# Altium schematic sheet SMPS.SchDoc: Title (part 2 of 2)
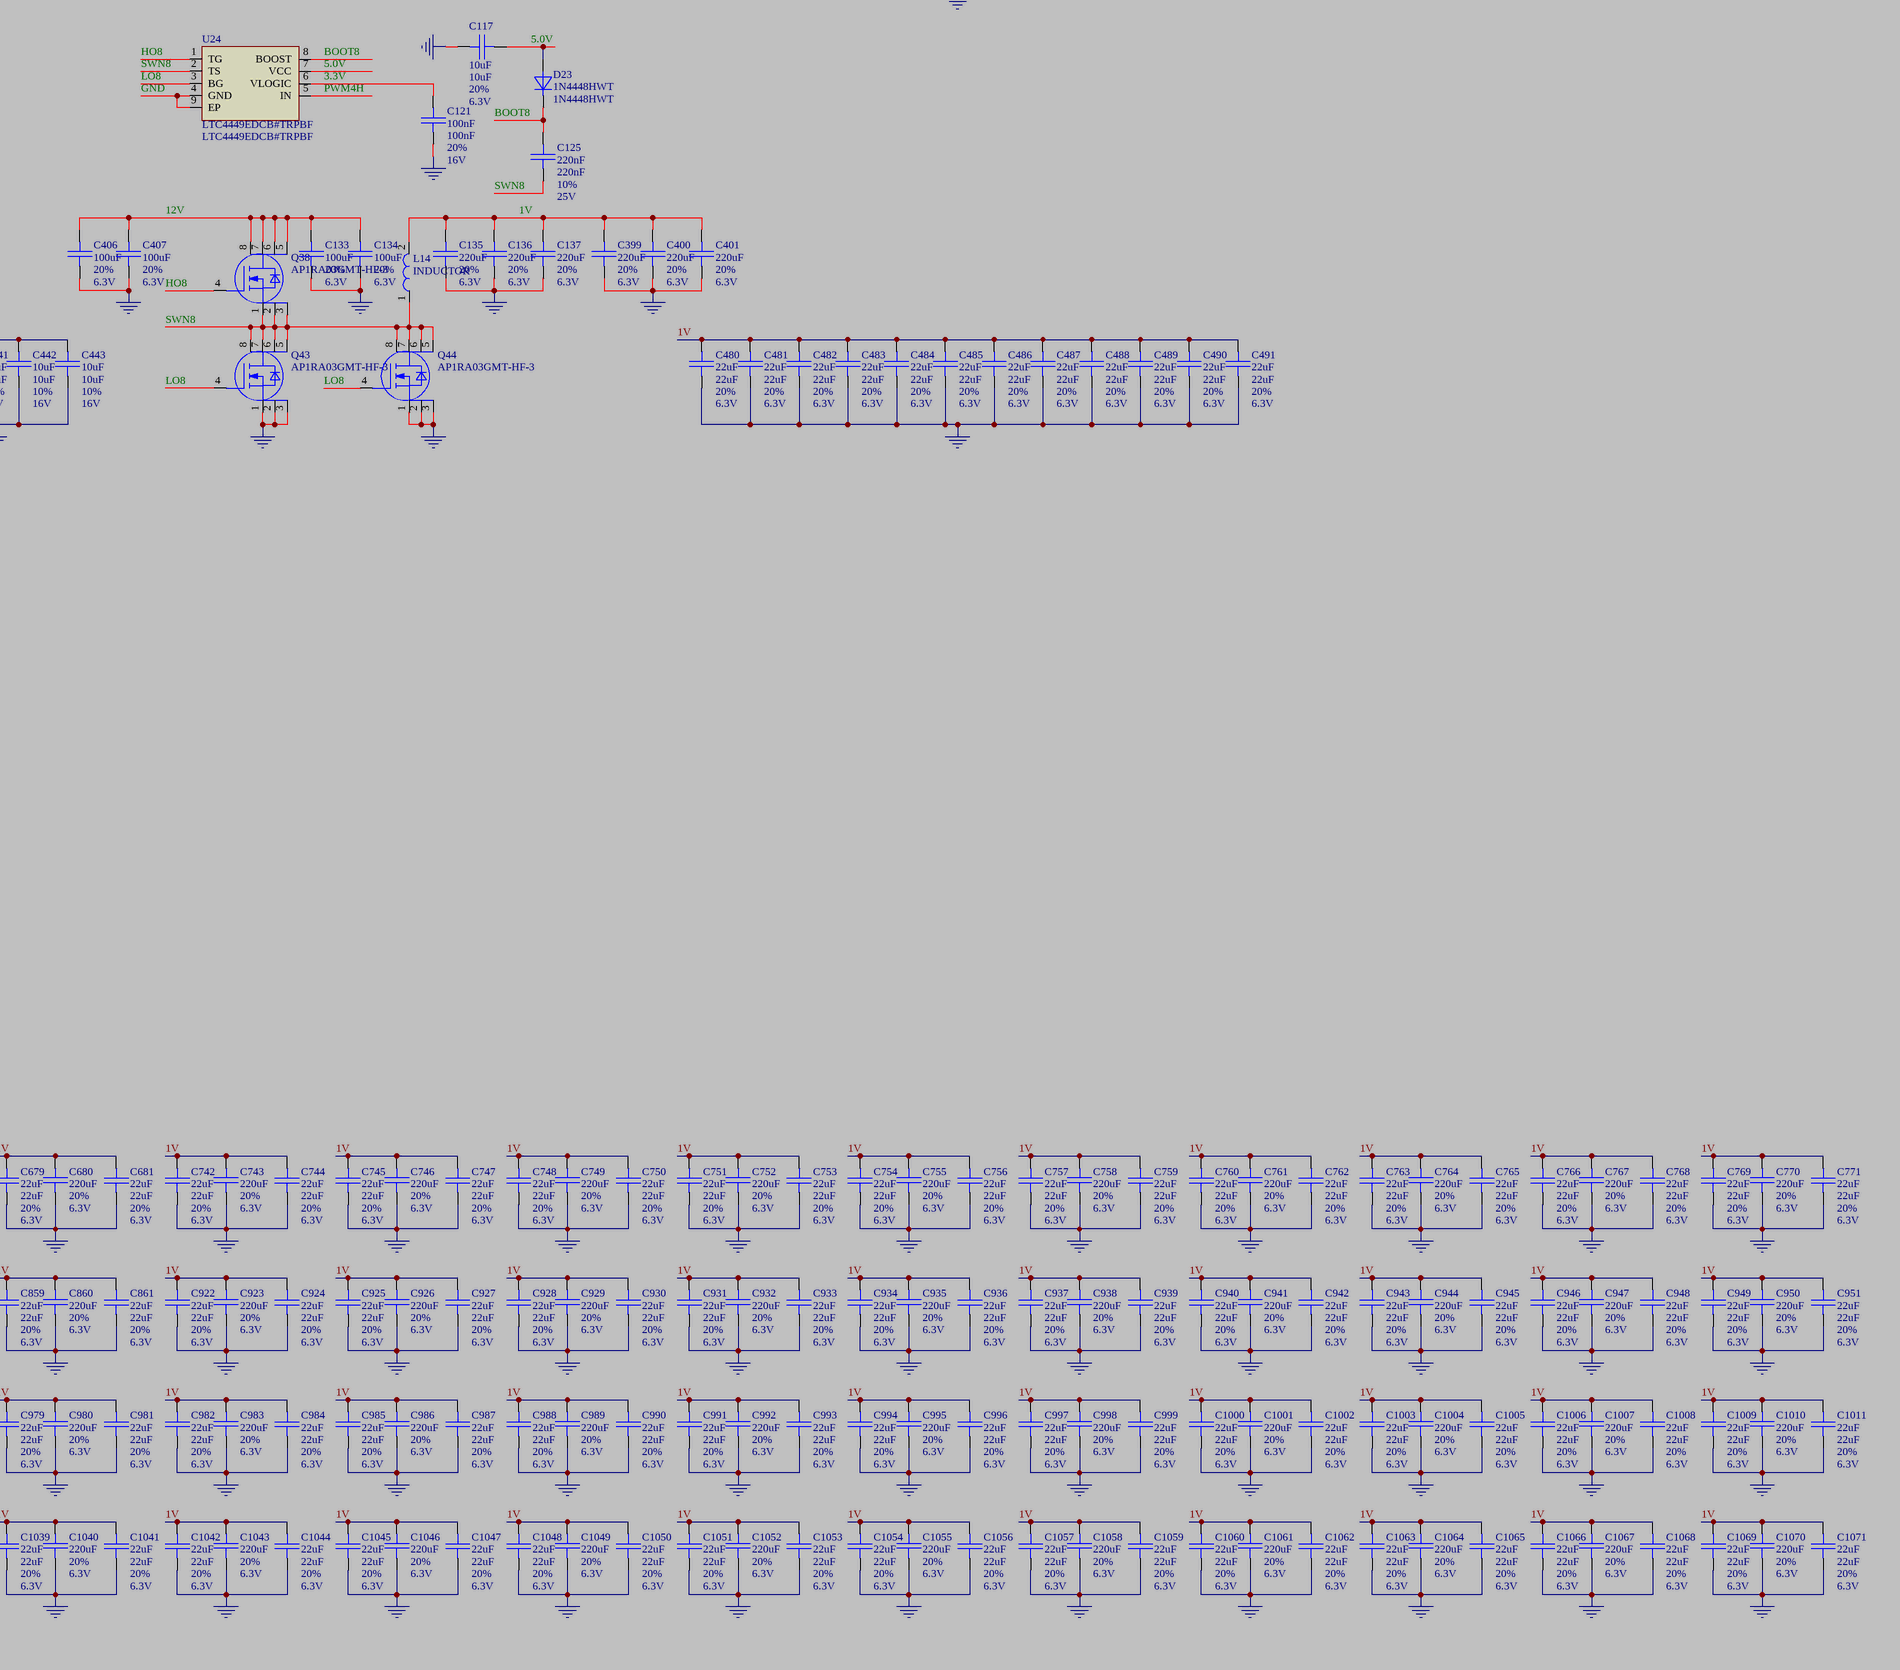
[diagram p4: SMPS.SchDoc, bottom right]

## Nets
GND: C20.1 C21.1 C24.2 C25.2 C32.1 C33.1 C34.1 C35.1 C37.1 C38.1 C39.1 C40.1 C41.1 C52.1 C53.1 C56.2 C57.2 C64.1 C65.1 C66.1 C67.1 C68.1 C69.1 C70.1 C71.1 C72.1 C73.1 C84.1 C85.1 C88.2 C89.2 C96.1 C97.1 C98.1 C99.1 C100.1 C101.1 C102.1 C103.1 C104.1 C105.1 C116.1 C117.1 C120.2 C121.2 C128.1 C129.1 C130.1 C131.1 C132.1 C133.1 C134.1 C135.1 C136.1 C137.1 C236.1 C323.2 C324.2 C325.2 C326.2 C327.2 C328.2 C329.2 C330.2 C331.2 C332.2 C333.2 C334.2 C335.2 C336.2 C337.2 C338.2 C339.2 C340.2 C341.2 C342.2 C343.2 C344.2 C345.2 C346.2 C348.1 C349.1 C350.1 C351.1 C352.1 C353.2 C354.2 C355.2 C356.2 C357.2 C358.2 C359.2 C360.2 C361.2 C362.2 C363.2 C364.2 C365.2 C366.2 C367.2 C368.2 C369.2 C370.2 C371.2 C372.2 C373.2 C374.2 C375.2 C376.2 C377.2 C378.2 C379.2 C380.2 C381.2 C382.2 C383.2 C384.2 C385.2 C386.2 C387.2 C388.2 C389.2 C390.2 C391.2 C392.2 C393.1 C394.1 C395.1 C396.1 C397.1 C398.1 C399.1 C400.1 C401.1 C402.1 C403.1 C404.1 C405.1 C406.1 C407.1 C408.1 C409.1 C410.1 C411.1 C412.1 C413.1 C414.1 C415.1 C416.1 C417.1 C418.1 C419.1 C420.1 C421.1 C422.1 C423.1 C424.1 C425.1 C426.1 C427.1 C428.2 C429.2 C430.2 C431.2 C432.2 C433.2 C434.2 C435.2 C436.2 C437.2 C438.2 C439.2 C440.2 C441.2 C442.2 C443.2 C444.2 C445.2 C446.2 C447.2 C448.2 C449.2 C450.2 C451.2 C452.2 C453.2 C454.2 C455.2 C456.2 C457.2 C458.2 C459.2 C460.2 C461.2 C462.2 C463.2 C464.2 C465.2 C466.2 C467.2 C468.2 C469.2 C470.2 C471.2 C472.2 C473.2 C474.2 C475.2 C476.2 C477.2 C478.2 C479.2 C480.2 C481.2 C482.2 C483.2 C484.2 C485.2 C486.2 C487.2 C488.2 C489.2 C490.2 C491.2 C593.1 C596.1 C598.2 C599.1 C600.2 C602.1 C603.2 C605.1 C606.2 C640.2 C642.2 C643.2 C645.2 C646.2 C652.2 C653.1 C654.2 C655.2 C656.1 C657.2 C658.2 C659.1 C660.2 C661.2 C662.1 C663.2 C664.2 C665.1 C666.2 C667.2 C668.1 C669.2 C670.2 C671.1 C672.2 C673.2 C674.1 C675.2 C676.2 C677.1 C678.2 C679.2 C680.1 C681.2 C686.1 C688.2 C689.1 C692.1 C695.1 C711.2 C712.2 C714.2 C715.2 C717.2 C742.2 C743.1 C744.2 C745.2 C746.1 C747.2 C748.2 C749.1 C750.2 C751.2 C752.1 C753.2 C754.2 C755.1 C756.2 C757.2 C758.1 C759.2 C760.2 C761.1 C762.2 C763.2 C764.1 C765.2 C766.2 C767.1 C768.2 C769.2 C770.1 C771.2 C776.1 C779.1 C782.1 C785.1 C807.2 C808.2 C810.2 C811.2 C813.2 C814.2 C832.2 C833.1 C834.2 C835.2 C836.1 C837.2 C838.2 C839.1 C840.2 C841.2 C842.1 C843.2 C844.2 C845.1 C846.2 C847.2 C848.1 C849.2 C850.2 C851.1 C852.2 C853.2 C854.1 C855.2 C856.2 C857.1 C858.2 C859.2 C860.1 C861.2 C866.1 C868.2 C869.1 C872.1 C876.2 C877.2 C879.2 C880.2 C882.2 C913.2 C915.2 C916.2 C918.2 C919.2 C922.2 C923.1 C924.2 C925.2 C926.1 C927.2 C928.2 C929.1 C930.2 C931.2 C932.1 C933.2 C934.2 C935.1 C936.2 C937.2 C938.1 C939.2 C940.2 C941.1 C942.2 C943.2 C944.1 C945.2 C946.2 C947.1 C948.2 C949.2 C950.1 C951.2 C952.2 C953.1 C954.2 C955.2 C956.1 C957.2 C958.2 C959.1 C960.2 C961.2 C962.1 C963.2 C964.2 C965.1 C966.2 C967.2 C968.1 C969.2 C970.2 C971.1 C972.2 C973.2 C974.1 C975.2 C976.2 C977.1 C978.2 C979.2 C980.1 C981.2 C982.2 C983.1 C984.2 C985.2 C986.1 C987.2 C988.2 C989.1 C990.2 C991.2 C992.1 C993.2 C994.2 C995.1 C996.2 C997.2 C998.1 C999.2 C1000.2 C1001.1 C1002.2 C1003.2 C1004.1 C1005.2 C1006.2 C1007.1 C1008.2 C1009.2 C1010.1 C1011.2 C1012.2 C1013.1 C1014.2 C1015.2 C1016.1 C1017.2 C1018.2 C1019.1 C1020.2 C1021.2 C1022.1 C1023.2 C1024.2 C1025.1 C1026.2 C1027.2 C1028.1 C1029.2 C1030.2 C1031.1 C1032.2 C1033.2 C1034.1 C1035.2 C1036.2 C1037.1 C1038.2 C1039.2 C1040.1 C1041.2 C1042.2 C1043.1 C1044.2 C1045.2 C1046.1 C1047.2 C1048.2 C1049.1 C1050.2 C1051.2 C1052.1 C1053.2 C1054.2 C1055.1 C1056.2 C1057.2 C1058.1 C1059.2 C1060.2 C1061.1 C1062.2 C1063.2 C1064.1 C1065.2 C1066.2 C1067.1 C1068.2 C1069.2 C1070.1 C1071.2 Q5.1(S) Q5.2(S) Q5.3(S) Q6.1(S) Q6.2(S) Q6.3(S) Q7.1(S) Q7.2(S) Q7.3(S) Q8.1(S) Q8.2(S) Q8.3(S) Q17.1(S) Q17.2(S) Q17.3(S) Q18.1(S) Q18.2(S) Q18.3(S) Q19.1(S) Q19.2(S) Q19.3(S) Q20.1(S) Q20.2(S) Q20.3(S) Q29.1(S) Q29.2(S) Q29.3(S) Q30.1(S) Q30.2(S) Q30.3(S) Q31.1(S) Q31.2(S) Q31.3(S) Q32.1(S) Q32.2(S) Q32.3(S) Q41.1(S) Q41.2(S) Q41.3(S) Q42.1(S) Q42.2(S) Q42.3(S) Q43.1(S) Q43.2(S) Q43.3(S) Q44.1(S) Q44.2(S) Q44.3(S) U11.4(GND) U11.9(EP) U12.4(GND) U12.9(EP) U15.4(GND) U15.9(EP) U16.4(GND) U16.9(EP) U19.4(GND) U19.9(EP) U20.4(GND) U20.9(EP) U23.4(GND) U23.9(EP) U24.4(GND) U24.9(EP)
1V: C34.2 C35.2 C39.2 C40.2 C41.2 C66.2 C67.2 C68.2 C71.2 C72.2 C73.2 C98.2 C99.2 C100.2 C103.2 C104.2 C105.2 C130.2 C131.2 C132.2 C135.2 C136.2 C137.2 C236.2 C323.1 C324.1 C325.1 C326.1 C327.1 C328.1 C329.1 C330.1 C331.1 C332.1 C333.1 C334.1 C335.1 C336.1 C337.1 C338.1 C339.1 C340.1 C341.1 C342.1 C343.1 C344.1 C345.1 C346.1 C350.2 C351.2 C352.2 C353.1 C354.1 C355.1 C356.1 C357.1 C358.1 C359.1 C360.1 C361.1 C362.1 C363.1 C364.1 C365.1 C366.1 C367.1 C368.1 C369.1 C370.1 C371.1 C372.1 C373.1 C374.1 C375.1 C376.1 C393.2 C394.2 C395.2 C396.2 C397.2 C398.2 C399.2 C400.2 C401.2 C408.2 C409.2 C410.2 C411.2 C412.2 C413.2 C414.2 C415.2 C416.2 C417.2 C418.2 C419.2 C444.1 C445.1 C446.1 C447.1 C448.1 C449.1 C450.1 C451.1 C452.1 C453.1 C454.1 C455.1 C456.1 C457.1 C458.1 C459.1 C460.1 C461.1 C462.1 C463.1 C464.1 C465.1 C466.1 C467.1 C468.1 C469.1 C470.1 C471.1 C472.1 C473.1 C474.1 C475.1 C476.1 C477.1 C478.1 C479.1 C480.1 C481.1 C482.1 C483.1 C484.1 C485.1 C486.1 C487.1 C488.1 C489.1 C490.1 C491.1 C652.1 C653.2 C654.1 C655.1 C656.2 C657.1 C658.1 C659.2 C660.1 C661.1 C662.2 C663.1 C664.1 C665.2 C666.1 C667.1 C668.2 C669.1 C670.1 C671.2 C672.1 C673.1 C674.2 C675.1 C676.1 C677.2 C678.1 C679.1 C680.2 C681.1 C742.1 C743.2 C744.1 C745.1 C746.2 C747.1 C748.1 C749.2 C750.1 C751.1 C752.2 C753.1 C754.1 C755.2 C756.1 C757.1 C758.2 C759.1 C760.1 C761.2 C762.1 C763.1 C764.2 C765.1 C766.1 C767.2 C768.1 C769.1 C770.2 C771.1 C832.1 C833.2 C834.1 C835.1 C836.2 C837.1 C838.1 C839.2 C840.1 C841.1 C842.2 C843.1 C844.1 C845.2 C846.1 C847.1 C848.2 C849.1 C850.1 C851.2 C852.1 C853.1 C854.2 C855.1 C856.1 C857.2 C858.1 C859.1 C860.2 C861.1 C922.1 C923.2 C924.1 C925.1 C926.2 C927.1 C928.1 C929.2 C930.1 C931.1 C932.2 C933.1 C934.1 C935.2 C936.1 C937.1 C938.2 C939.1 C940.1 C941.2 C942.1 C943.1 C944.2 C945.1 C946.1 C947.2 C948.1 C949.1 C950.2 C951.1 C952.1 C953.2 C954.1 C955.1 C956.2 C957.1 C958.1 C959.2 C960.1 C961.1 C962.2 C963.1 C964.1 C965.2 C966.1 C967.1 C968.2 C969.1 C970.1 C971.2 C972.1 C973.1 C974.2 C975.1 C976.1 C977.2 C978.1 C979.1 C980.2 C981.1 C982.1 C983.2 C984.1 C985.1 C986.2 C987.1 C988.1 C989.2 C990.1 C991.1 C992.2 C993.1 C994.1 C995.2 C996.1 C997.1 C998.2 C999.1 C1000.1 C1001.2 C1002.1 C1003.1 C1004.2 C1005.1 C1006.1 C1007.2 C1008.1 C1009.1 C1010.2 C1011.1 C1012.1 C1013.2 C1014.1 C1015.1 C1016.2 C1017.1 C1018.1 C1019.2 C1020.1 C1021.1 C1022.2 C1023.1 C1024.1 C1025.2 C1026.1 C1027.1 C1028.2 C1029.1 C1030.1 C1031.2 C1032.1 C1033.1 C1034.2 C1035.1 C1036.1 C1037.2 C1038.1 C1039.1 C1040.2 C1041.1 C1042.1 C1043.2 C1044.1 C1045.1 C1046.2 C1047.1 C1048.1 C1049.2 C1050.1 C1051.1 C1052.2 C1053.1 C1054.1 C1055.2 C1056.1 C1057.1 C1058.2 C1059.1 C1060.1 C1061.2 C1062.1 C1063.1 C1064.2 C1065.1 C1066.1 C1067.2 C1068.1 C1069.1 C1070.2 C1071.1 L1.2 L2.2 L5.2 L6.2 L9.2 L10.2 L13.2 L14.2 ; port 1V
3.3V: C24.1 C25.1 C56.1 C57.1 C88.1 C89.1 C120.1 C121.1 U11.6(VLOGIC) U12.6(VLOGIC) U15.6(VLOGIC) U16.6(VLOGIC) U19.6(VLOGIC) U20.6(VLOGIC) U23.6(VLOGIC) U24.6(VLOGIC) ; port 3.3V
5.0V: C20.2 C21.2 C52.2 C53.2 C84.2 C85.2 C116.2 C117.2 D10.2(A) D11.2(A) D14.2(A) D15.2(A) D18.2(A) D19.2(A) D22.2(A) D23.2(A) U11.7(VCC) U12.7(VCC) U15.7(VCC) U16.7(VCC) U19.7(VCC) U20.7(VCC) U23.7(VCC) U24.7(VCC) ; port 5.0V
12V: C32.2 C33.2 C37.2 C38.2 C64.2 C65.2 C69.2 C70.2 C96.2 C97.2 C101.2 C102.2 C128.2 C129.2 C133.2 C134.2 C348.2 C349.2 C377.1 C378.1 C379.1 C380.1 C381.1 C382.1 C383.1 C384.1 C385.1 C386.1 C387.1 C388.1 C389.1 C390.1 C391.1 C392.1 C402.2 C403.2 C404.2 C405.2 C406.2 C407.2 C420.2 C421.2 C422.2 C423.2 C424.2 C425.2 C426.2 C427.2 C428.1 C429.1 C430.1 C431.1 C432.1 C433.1 C434.1 C435.1 C436.1 C437.1 C438.1 C439.1 C440.1 C441.1 C442.1 C443.1 C593.2 C596.2 C598.1 C599.2 C600.1 C602.2 C603.1 C605.2 C606.1 C640.1 C642.1 C643.1 C645.1 C646.1 C686.2 C688.1 C689.2 C692.2 C695.2 C711.1 C712.1 C714.1 C715.1 C717.1 C776.2 C779.2 C782.2 C785.2 C807.1 C808.1 C810.1 C811.1 C813.1 C814.1 C866.2 C868.1 C869.2 C872.2 C876.1 C877.1 C879.1 C880.1 C882.1 C913.1 C915.1 C916.1 C918.1 C919.1 Q1.5(D) Q1.6(D) Q1.7(D) Q1.8(D) Q2.5(D) Q2.6(D) Q2.7(D) Q2.8(D) Q13.5(D) Q13.6(D) Q13.7(D) Q13.8(D) Q14.5(D) Q14.6(D) Q14.7(D) Q14.8(D) Q25.5(D) Q25.6(D) Q25.7(D) Q25.8(D) Q26.5(D) Q26.6(D) Q26.7(D) Q26.8(D) Q37.5(D) Q37.6(D) Q37.7(D) Q37.8(D) Q38.5(D) Q38.6(D) Q38.7(D) Q38.8(D) ; port 12V
BOOT1: C28.1 D10.1(C) U11.8(BOOST)
BOOT2: C60.1 D14.1(C) U15.8(BOOST)
BOOT3: C92.1 D18.1(C) U19.8(BOOST)
BOOT4: C124.1 D22.1(C) U23.8(BOOST)
BOOT5: C29.1 D11.1(C) U12.8(BOOST)
BOOT6: C61.1 D15.1(C) U16.8(BOOST)
BOOT7: C93.1 D19.1(C) U20.8(BOOST)
BOOT8: C125.1 D23.1(C) U24.8(BOOST)
HO1: Q1.4(G) U11.1(TG)
HO2: Q13.4(G) U15.1(TG)
HO3: Q25.4(G) U19.1(TG)
HO4: Q37.4(G) U23.1(TG)
HO5: Q2.4(G) U12.1(TG)
HO6: Q14.4(G) U16.1(TG)
HO7: Q26.4(G) U20.1(TG)
HO8: Q38.4(G) U24.1(TG)
LO1: Q5.4(G) Q6.4(G) U11.3(BG)
LO2: Q17.4(G) Q18.4(G) U15.3(BG)
LO3: Q29.4(G) Q30.4(G) U19.3(BG)
LO4: Q41.4(G) Q42.4(G) U23.3(BG)
LO5: Q7.4(G) Q8.4(G) U12.3(BG)
LO6: Q19.4(G) Q20.4(G) U16.3(BG)
LO7: Q31.4(G) Q32.4(G) U20.3(BG)
LO8: Q43.4(G) Q44.4(G) U24.3(BG)
PWM1H: U12.5(IN) ; port PWM1H
PWM1L: U11.5(IN) ; port PWM1L
PWM2H: U16.5(IN) ; port PWM2H
PWM2L: U15.5(IN) ; port PWM2L
PWM3H: U20.5(IN) ; port PWM3H
PWM3L: U19.5(IN) ; port PWM3L
PWM4H: U24.5(IN) ; port PWM4H
PWM4L: U23.5(IN) ; port PWM4L
SWN1: C28.2 L1.1 Q1.1(S) Q1.2(S) Q1.3(S) Q5.5(D) Q5.6(D) Q5.7(D) Q5.8(D) Q6.5(D) Q6.6(D) Q6.7(D) Q6.8(D) U11.2(TS)
SWN2: C60.2 L5.1 Q13.1(S) Q13.2(S) Q13.3(S) Q17.5(D) Q17.6(D) Q17.7(D) Q17.8(D) Q18.5(D) Q18.6(D) Q18.7(D) Q18.8(D) U15.2(TS)
SWN3: C92.2 L9.1 Q25.1(S) Q25.2(S) Q25.3(S) Q29.5(D) Q29.6(D) Q29.7(D) Q29.8(D) Q30.5(D) Q30.6(D) Q30.7(D) Q30.8(D) U19.2(TS)
SWN4: C124.2 L13.1 Q37.1(S) Q37.2(S) Q37.3(S) Q41.5(D) Q41.6(D) Q41.7(D) Q41.8(D) Q42.5(D) Q42.6(D) Q42.7(D) Q42.8(D) U23.2(TS)
SWN5: C29.2 L2.1 Q2.1(S) Q2.2(S) Q2.3(S) Q7.5(D) Q7.6(D) Q7.7(D) Q7.8(D) Q8.5(D) Q8.6(D) Q8.7(D) Q8.8(D) U12.2(TS)
SWN6: C61.2 L6.1 Q14.1(S) Q14.2(S) Q14.3(S) Q19.5(D) Q19.6(D) Q19.7(D) Q19.8(D) Q20.5(D) Q20.6(D) Q20.7(D) Q20.8(D) U16.2(TS)
SWN7: C93.2 L10.1 Q26.1(S) Q26.2(S) Q26.3(S) Q31.5(D) Q31.6(D) Q31.7(D) Q31.8(D) Q32.5(D) Q32.6(D) Q32.7(D) Q32.8(D) U20.2(TS)
SWN8: C125.2 L14.1 Q38.1(S) Q38.2(S) Q38.3(S) Q43.5(D) Q43.6(D) Q43.7(D) Q43.8(D) Q44.5(D) Q44.6(D) Q44.7(D) Q44.8(D) U24.2(TS)

## Library data of the parts
C20 C21 C52 C53 C84 C85 C116 C117 = CAP000043646: DB_MANUFACTURER_PART: KEMET    C0603C106M9PAC; DB_PART_TYPE: Ceramic_SMD\Standard_X5R; NOTE: <NOTE>; DB_APPROVED_BY: ISHIDDEN=T; DB_APPROVED_ON: 09.10.2010 г.; DB_DESCRIPTION: C X5R 10uF 20% 6.3V 0603; DB_PACKAGE: 0603; DB_STATUS: NEW; DB_T_RANGE: -55 to 85; DB_PART_NUMBER: CAP000043646; DB_VALUE: 10uF; DB_CERTIFIED: ISHIDDEN=T; DB_DATASHEET: http://john.epiqdesign.com/projects/CIS_Datasheets/F3102_CE_Kemet.pdf?rev=92&sc=0; DB_LEADTIME: ISHIDDEN=T; DB_MOQ: ISHIDDEN=T; DB_PCB_DEVICE: SMD_0603_CAPC1608X95N; DB_PRICE: ISHIDDEN=T; DB_PRICE_DATE: ISHIDDEN=T
C24 C25 C56 C57 C88 C89 C120 C121 = CAP000022751: DB_PART_TYPE: Ceramic_SMD\Open_Mode_X7R; DB_MANUFACTURER_PART: KEMET    C0402F104M4RAC; NOTE: <NOTE>; DB_T_RANGE: -55 to 125; DB_PACKAGE: 0402; DB_DESCRIPTION: C X7R 100nF 20% 16V 0402; DB_CERTIFIED: ISHIDDEN=T; DB_APPROVED_ON: 09.10.2010 г.; DB_STATUS: NEW; DB_PART_NUMBER: CAP000022751; DB_VALUE: 100nF; DB_PCB_DEVICE: SMD_0402_CAPC1005X55N; DB_PRICE: ISHIDDEN=T; DB_LEADTIME: ISHIDDEN=T; DB_MOQ: ISHIDDEN=T; DB_PRICE_DATE: ISHIDDEN=T; DB_APPROVED_BY: ISHIDDEN=T; DB_DATASHEET: http://john.epiqdesign.com/projects/CIS_Datasheets/F3102_CE_Kemet.pdf?rev=92&sc=0
C28 C29 C60 C61 C92 C93 C124 C125 = CAP000022968: DB_PART_TYPE: Ceramic_SMD\Open_Mode_X7R; DB_MANUFACTURER_PART: KEMET    C0603F224K3RAC; NOTE: <NOTE>; DB_T_RANGE: -55 to 125; DB_PACKAGE: 0603; DB_DESCRIPTION: C X7R 220nF 10% 25V 0603; DB_CERTIFIED: ISHIDDEN=T; DB_APPROVED_ON: 09.10.2010 г.; DB_STATUS: NEW; DB_PART_NUMBER: CAP000022968; DB_VALUE: 220nF; DB_PCB_DEVICE: SMD_0603_CAPC1608X95N; DB_PRICE: ISHIDDEN=T; DB_LEADTIME: ISHIDDEN=T; DB_MOQ: ISHIDDEN=T; DB_PRICE_DATE: ISHIDDEN=T; DB_APPROVED_BY: ISHIDDEN=T; DB_DATASHEET: http://john.epiqdesign.com/projects/CIS_Datasheets/F3102_CE_Kemet.pdf?rev=92&sc=0
C32 C33 C37 C38 C64 C65 C69 C70 C96 C97 C101 C102 C128 C129 C133 C134 C348 C349 C402-C407 C420-C427 C593 C596 C599 C602 C605 C686 C689 C692 C695 C776 C779 C782 C785 C866 C869 C872 = CAP000043701: DB_PART_TYPE: Ceramic_SMD\Standard_X5R; DB_MANUFACTURER_PART: KEMET    C1210C107M9PAC; NOTE: <NOTE>; DB_T_RANGE: -55 to 85; DB_PACKAGE: 1210; DB_DESCRIPTION: C X5R 100uF 20% 6.3V 1210; DB_CERTIFIED: ISHIDDEN=T; DB_APPROVED_ON: 09.10.2010 г.; DB_STATUS: NEW; DB_PART_NUMBER: CAP000043701; DB_VALUE: 100uF; DB_PCB_DEVICE: SMD_1210_CAPC3225X270N; DB_PRICE: ISHIDDEN=T; DB_LEADTIME: ISHIDDEN=T; DB_MOQ: ISHIDDEN=T; DB_PRICE_DATE: ISHIDDEN=T; DB_APPROVED_BY: ISHIDDEN=T; DB_DATASHEET: http://john.epiqdesign.com/projects/CIS_Datasheets/F3102_CE_Kemet.pdf?rev=92&sc=0
C34 C35 C39-C41 C66-C68 C71-C73 C98-C100 C103-C105 C130-C132 C135-C137 C236 C350-C352 C393-C401 C408-C419 C653 C656 C659 C662 C665 C668 C671 C674 C677 C680 C743 C746 C749 C752 C755 C758 C761 C764 C767 C770 C833 C836 C839 C842 C845 C848 C851 C854 C857 C860 C923 C926 C929 C932 C935 C938 C941 C944 C947 C950 C953 C956 C959 C962 C965 C968 C971 C974 C977 C980 C983 C986 C989 C992 C995 C998 C1001 C1004 C1007 C1010 C1013 C1016 C1019 C1022 C1025 C1028 C1031 C1034 C1037 C1040 C1043 C1046 C1049 C1052 C1055 C1058 C1061 C1064 C1067 C1070 = CAP000047355: DB_PART_TYPE: Ceramic_SMD\Standard_X5R; DB_MANUFACTURER_PART: SAMSUNG    CL32A227MQVNNNE; NOTE: <NOTE>; DB_T_RANGE: -55 to 85; DB_PACKAGE: 1210; DB_DESCRIPTION: C X5R 220uF 20% 6.3V 1210; DB_CERTIFIED: ISHIDDEN=T; DB_APPROVED_BY: VSN; DB_APPROVED_ON: 07.5.2014 г. 11:28:08; DB_STATUS: NEW; DB_PART_NUMBER: CAP000047355; DB_VALUE: 220uF; DB_PCB_DEVICE: SMD_1210_CAPC3225X279N; DB_DATASHEET: http://john.epiqdesign.com/projects/CIS_Datasheets/CAP_CL32A227MQVNNNE.pdf?rev=1401&sc=0
C323-C346 C353-C376 C444-C491 C652 C654 C655 C657 C658 C660 C661 C663 C664 C666 C667 C669 C670 C672 C673 C675 C676 C678 C679 C681 C742 C744 C745 C747 C748 C750 C751 C753 C754 C756 C757 C759 C760 C762 C763 C765 C766 C768 C769 C771 C832 C834 C835 C837 C838 C840 C841 C843 C844 C846 C847 C849 C850 C852 C853 C855 C856 C858 C859 C861 C922 C924 C925 C927 C928 C930 C931 C933 C934 C936 C937 C939 C940 C942 C943 C945 C946 C948 C949 C951 C952 C954 C955 C957 C958 C960 C961 C963 C964 C966 C967 C969 C970 C972 C973 C975 C976 C978 C979 C981 C982 C984 C985 C987 C988 C990 C991 C993 C994 C996 C997 C999 C1000 C1002 C1003 C1005 C1006 C1008 C1009 C1011 C1012 C1014 C1015 C1017 C1018 C1020 C1021 C1023 C1024 C1026 C1027 C1029 C1030 C1032 C1033 C1035 C1036 C1038 C1039 C1041 C1042 C1044 C1045 C1047 C1048 C1050 C1051 C1053 C1054 C1056 C1057 C1059 C1060 C1062 C1063 C1065 C1066 C1068 C1069 C1071 = CAP000043686: DB_PART_TYPE: Ceramic_SMD\Standard_X5R; DB_MANUFACTURER_PART: KEMET    C0805C226M9PAC; NOTE: <NOTE>; DB_T_RANGE: -55 to 85; DB_PACKAGE: 0805; DB_DESCRIPTION: C X5R 22uF 20% 6.3V 0805; DB_CERTIFIED: ISHIDDEN=T; DB_APPROVED_ON: 09.10.2010 г.; DB_STATUS: NEW; DB_PART_NUMBER: CAP000043686; DB_VALUE: 22uF; DB_PCB_DEVICE: SMD_0805_CAPC2012X145N; DB_PRICE: ISHIDDEN=T; DB_LEADTIME: ISHIDDEN=T; DB_MOQ: ISHIDDEN=T; DB_PRICE_DATE: ISHIDDEN=T; DB_APPROVED_BY: ISHIDDEN=T; DB_DATASHEET: http://john.epiqdesign.com/projects/CIS_Datasheets/F3102_CE_Kemet.pdf?rev=92&sc=0
C377-C392 C428-C443 C598 C600 C603 C606 C640 C642 C643 C645 C646 C688 C711 C712 C714 C715 C717 C807 C808 C810 C811 C813 C814 C868 C876 C877 C879 C880 C882 C913 C915 C916 C918 C919 = CAP000043636: DB_PART_TYPE: Ceramic_SMD\Standard_X5R; DB_MANUFACTURER_PART: KEMET    C0805C106K4PAC; NOTE: <NOTE>; DB_T_RANGE: -55 to 85; DB_PACKAGE: 0805; DB_DESCRIPTION: C X5R 10uF 10% 16V 0805; DB_CERTIFIED: ISHIDDEN=T; DB_APPROVED_ON: 09.10.2010 г.; DB_STATUS: NEW; DB_PART_NUMBER: CAP000043636; DB_VALUE: 10uF; DB_PCB_DEVICE: SMD_0805_CAPC2012X145N; DB_PRICE: ISHIDDEN=T; DB_LEADTIME: ISHIDDEN=T; DB_MOQ: ISHIDDEN=T; DB_PRICE_DATE: ISHIDDEN=T; DB_APPROVED_BY: ISHIDDEN=T; DB_DATASHEET: http://john.epiqdesign.com/projects/CIS_Datasheets/F3102_CE_Kemet.pdf?rev=92&sc=0
D10 D11 D14 D15 D18 D19 D22 D23 = DDE000001203: DB_PART_TYPE: Fast; DB_MANUFACTURER_PART: Diodes        1N4448HWT; NOTE: <NOTE>; DB_T_RANGE: -65 to 150; DB_VOLTAGE: 80V; DB_CURRENT: 125mA; DB_PACKAGE: SOD523; DB_DESCRIPTION: D 1N4448HWT SOD523; DB_CERTIFIED: ISHIDDEN=T; DB_APPROVED_ON: 09.10.2010 г.; DB_STATUS: NEW; DB_PART_NUMBER: DDE000001203; DB_VALUE: 1N4448HWT; DB_PCB_DEVICE: SMD_SOD523_SOD1608X65N; DB_PRICE: ISHIDDEN=T; DB_LEADTIME: ISHIDDEN=T; DB_MOQ: ISHIDDEN=T; DB_PRICE_DATE: ISHIDDEN=T; DB_APPROVED_BY: ISHIDDEN=T; DB_DATASHEET: ISHIDDEN=T
L1 L2 L5 L6 L9 L10 L13 L14 = L: DB_PCB_DEVICE: SMT_INDM135130X800N
Q1 Q2 Q5-Q8 Q13 Q14 Q17-Q20 Q25 Q26 Q29-Q32 Q37 Q38 Q41-Q44 = TRA000001604: DB_PART_TYPE: MOSFET\N_Channel; DB_MANUFACTURER_PART: ADVANCED POWER ELECTRONICS CORP      AP1RA03GMT-HF-3; NOTE: <NOTE>; DB_T_RANGE: -55 to 150; DB_VOLTAGE: 30V; DB_CURRENT: 185A; DB_PACKAGE: PQFN 5x6B; DB_DESCRIPTION: TRANS AP1RA03GMT-HF-3 PQFN 5x6B; DB_CERTIFIED: ISHIDDEN=T; DB_APPROVED_BY: VSN; DB_APPROVED_ON: 07.5.2014 г. 12:55:44; DB_STATUS: NEW; DB_PART_NUMBER: TRA000001604; DB_VALUE: AP1RA03GMT-HF-3; DB_PCB_DEVICE: SMD_SOIC127P600X110-9AN; DB_DATASHEET: http://john.epiqdesign.com/projects/CIS_Datasheets/MOS_AP1RA03GMT-3.pdf?rev=1404&sc=0
U11 U12 U15 U16 U19 U20 U23 U24 = DRV000000079: DB_PART_TYPE: Power Driver; DB_MANUFACTURER_PART: LINEAR       LTC4449EDCB#TRPBF; DB_T_RANGE: -40 to 125; DB_PACKAGE: DFN-8 (2mmX3mm); DB_DESCRIPTION: IC  LTC4449EDCB#TRPBF   DFN-8 (2mmX3mm); DB_CERTIFIED: ISHIDDEN=T; DB_APPROVED_BY: VSN; DB_APPROVED_ON: 07.5.2014 г. 13:09:30; DB_STATUS: NEW; DB_PART_NUMBER: DRV000000079; DB_VALUE: LTC4449EDCB#TRPBF; DB_PCB_DEVICE: SMD_SON45P300X200X80-9N; DB_DATASHEET: http://john.epiqdesign.com/projects/CIS_Datasheets/IC_LTC4449.pdf?rev=1406&sc=0